# EAGLE design SAMD21E_Uno_Zero (EAGLE 7.3.0)
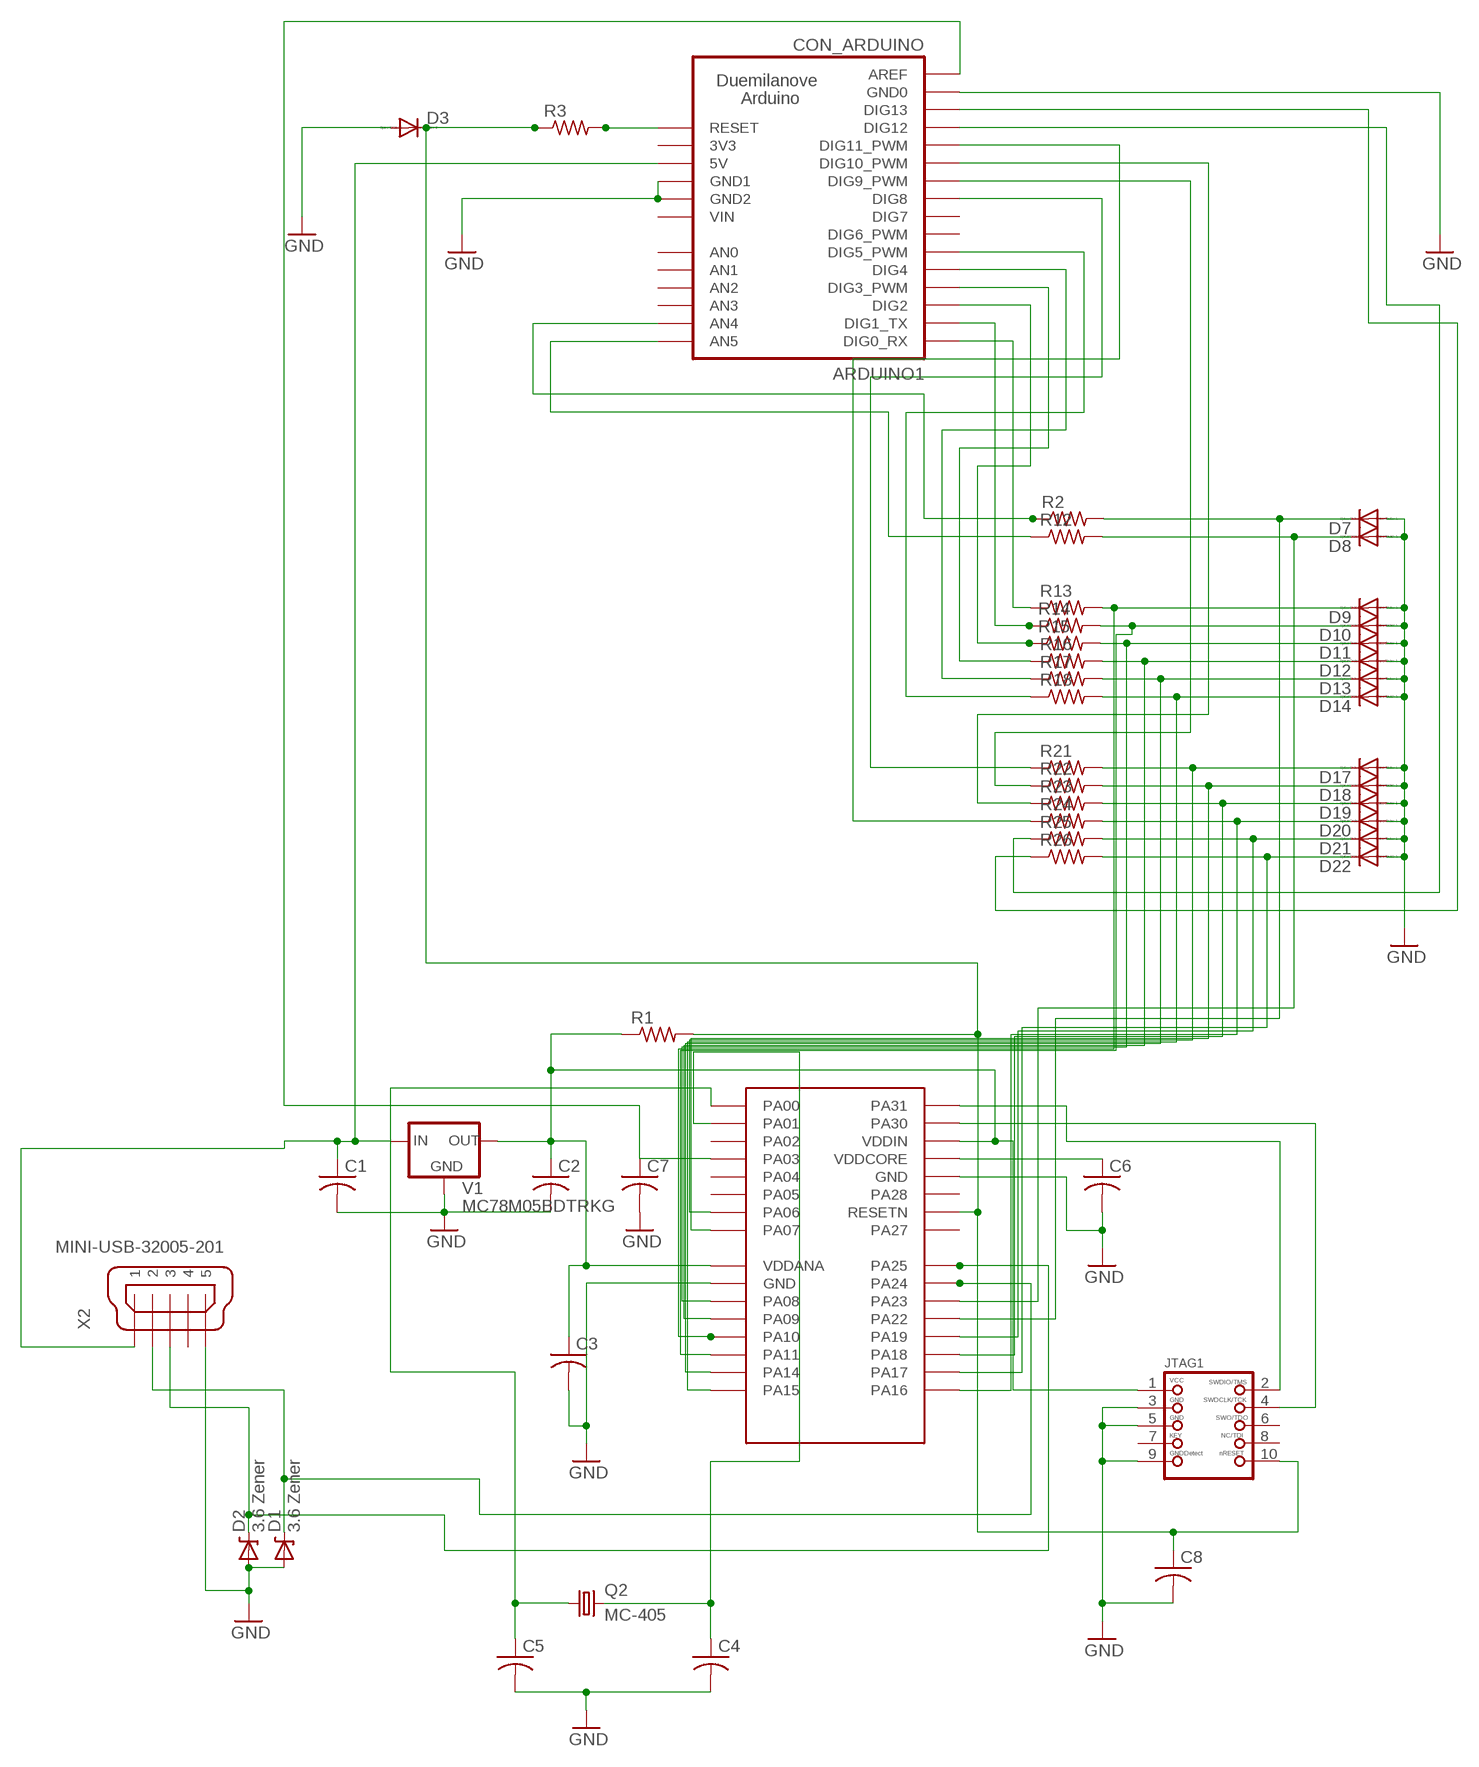
[diagram p0: schematic, sheet 1]

## Parts
ARDUINO1  CON_ARDUINO  [CON_ARDUINO]
C1  C-USC0603K  [C0603K]
C2  C-USC0603K  [C0603K]
C3  C-USC0603  [C0603]
C4  C-USC0603K  [C0603K]
C5  C-USC0603K  [C0603K]
C6  C-USC0603K  [C0603K]
C7  C-USC0603K  [C0603K]
C8  C-USC0603K  [C0603K]
D1  3.6 Zener  DIODE-ZENER-BZT52  [SOD-323]
D2  3.6 Zener  DIODE-ZENER-BZT52  [SOD-323]
D3  DIODE-SOD323-W  [SOD323-W]
D7  DIODE-SOD323-W  [SOD323-W]
D8  DIODE-SOD323-W  [SOD323-W]
D9  DIODE-SOD323-W  [SOD323-W]
D10  DIODE-SOD323-W  [SOD323-W]
D11  DIODE-SOD323-W  [SOD323-W]
D12  DIODE-SOD323-W  [SOD323-W]
D13  DIODE-SOD323-W  [SOD323-W]
D14  DIODE-SOD323-W  [SOD323-W]
D17  DIODE-SOD323-W  [SOD323-W]
D18  DIODE-SOD323-W  [SOD323-W]
D19  DIODE-SOD323-W  [SOD323-W]
D20  DIODE-SOD323-W  [SOD323-W]
D21  DIODE-SOD323-W  [SOD323-W]
D22  DIODE-SOD323-W  [SOD323-W]
JTAG1  JTAG-CORTEXM3  [2X05_1.27MM_SMT]
Q2  MC-405  [MC-405]
R1  R-US_R0603  [R0603]
R2  R-US_R0603  [R0603]
R3  R-US_R0603  [R0603]
R12  R-US_R0603  [R0603]
R13  R-US_R0603  [R0603]
R14  R-US_R0603  [R0603]
R15  R-US_R0603  [R0603]
R16  R-US_R0603  [R0603]
R17  R-US_R0603  [R0603]
R18  R-US_R0603  [R0603]
R21  R-US_R0603  [R0603]
R22  R-US_R0603  [R0603]
R23  R-US_R0603  [R0603]
R24  R-US_R0603  [R0603]
R25  R-US_R0603  [R0603]
R26  R-US_R0603  [R0603]
U$8  ATSAMD21E18A-AU  [32-TQFP]
V1  MC78M05BDTRKG  LP2950CDT-3.0  [DPACK]
X2  MINI-USB-32005-201  [32005-201]

## Nets
GND: ARDUINO1.GND0 ARDUINO1.GND1 ARDUINO1.GND2 C1.2 C2.2 C3.2 C4.2 C5.2 C6.2 C7.2 C8.2 D1.2(A) D2.2(A) D3.A D7.A D8.A D9.A D10.A D11.A D12.A D13.A D14.A D17.A D18.A D19.A D20.A D21.A D22.A JTAG1.3 JTAG1.5 JTAG1.9 U$8.10(GND) U$8.28(GND) V1.4(GND) X2.5
N$1: C2.1 C3.1 JTAG1.1 R1.1 U$8.9(VDDANA) U$8.30(VDDIN) V1.3(OUT)
N$2: JTAG1.4 U$8.31(PA30)
N$3: C4.1 Q2.2 U$8.2(PA01)
N$4: JTAG1.2 U$8.32(PA31)
N$5: C5.1 Q2.1 U$8.1(PA00)
N$6: ARDUINO1.RESET R3.2
N$7: C8.1 D3.C JTAG1.10 R1.2 R3.1 U$8.26(RESETN)
N$8: C6.1 U$8.29(VDDCORE)
N$10: D1.1(C) U$8.23(PA24) X2.2
N$11: D2.1(C) U$8.24(PA25) X2.3
N$12: ARDUINO1.AREF C7.1 U$8.4(PA03)
N$13: ARDUINO1.A_4(AN4) R2.1
N$14: ARDUINO1.A_5(AN5) R12.1
N$15: ARDUINO1.D_0(DIG0_RX) R13.1
N$16: ARDUINO1.5V C1.1 V1.1(IN) X2.1
N$17: ARDUINO1.D_1(DIG1_TX) R14.1
N$18: ARDUINO1.D_2(DIG2) R15.1
N$19: ARDUINO1.D_3(DIG3_PWM) R16.1
N$20: ARDUINO1.D_4(DIG4) R17.1
N$21: ARDUINO1.D_5(DIG5_PWM) R18.1
N$22: ARDUINO1.D_8(DIG8) R21.1
N$23: ARDUINO1.D_9(DIG9_PWM) R22.1
N$24: ARDUINO1.D_10(DIG10_PWM) R23.1
N$25: ARDUINO1.D_11(DIG11_PWM) R24.1
N$26: ARDUINO1.D_12(DIG12) R25.1
N$27: ARDUINO1.D_13(DIG13) R26.1
N$47: D7.C R2.2 U$8.21(PA22)
N$48: D8.C R12.2 U$8.22(PA23)
N$49: D9.C R13.2 U$8.13(PA10)
N$50: D10.C R14.2 U$8.14(PA11)
N$51: D11.C R15.2 U$8.11(PA08)
N$52: D12.C R16.2 U$8.12(PA09)
N$53: D13.C R17.2 U$8.15(PA14)
N$54: D14.C R18.2 U$8.16(PA15)
N$57: D17.C R21.2 U$8.7(PA06)
N$58: D18.C R22.2 U$8.8(PA07)
N$59: D19.C R23.2 U$8.19(PA18)
N$60: D20.C R24.2 U$8.17(PA16)
N$61: D21.C R25.2 U$8.20(PA19)
N$62: D22.C R26.2 U$8.18(PA17)
Unconnected: ARDUINO1.3V3 ARDUINO1.A_0(AN0) ARDUINO1.A_1(AN1) ARDUINO1.A_2(AN2) ARDUINO1.A_3(AN3) ARDUINO1.D_6(DIG6_PWM) ARDUINO1.D_7(DIG7) JTAG1.6 JTAG1.7 JTAG1.8 U$8.3(PA02) U$8.5(PA04) U$8.6(PA05) U$8.25(PA27) U$8.27(PA28) X2.4

## Power pins joined to a net without a drawn wire
VIN: ARDUINO1.VIN

## Library data of the parts
ARDUINO1 = dp_devices:CON_ARDUINO: Arduino board connector layout
C1 C2 C6-C8 = rcl:C-US: CAPACITOR, American symbol
C3-C5 = resistor:C-US: CAPACITOR, American symbol
D1 D2 = SparkFun:DIODE-ZENER: Zener Diode Production Part - 8199 3.4V Zener Voltage
D3 D7-D14 D17-D22 = diode:DIODE-: DIODE
JTAG1 = OLED_mod:JTAG-CORTEXM3: Serial Wire (SW-DP) Connector This standard 0.05" 10-pin connector is for use with the Cortex M0/M3's native SWD (serial wire debugger) interface (SW-DP). Some boards support a 20-pin combined JTAG+SWD connector (SWJ-DP), such as the LPC1700 family, but many smaller devices only work with SWD which typically use the smaller 10-pin SW-DP connecter (the LPC1300 family, for example, only supports SWD). 2x05 1.27mm/0.05" Connector: This is the standard SMT connector defined by ARM for all Cortex devices, and should be used in most situations and for forward-compatibility since any new devices coming to market will likely use this connector. MOLEX 10 Pin 0.1" Connector: This 0.1" 10 pin connector has the same pin layout as the standard 0.05" connector, but is easier to work with if you are using standard jumper wires or custom cables to connect your SWD hardware. MOLEX 20 Pin 0.1" Connector: This 0.1" 20 pin connector is the same model used for ARM7/ARM9 JTAG debuggers, but is connected to match the pins on the Segger J-Link for ARM (which supports both JTAG and SWD debugging). See the following document from ARM for more information on Cortex M3 Debug Connectors: http://infocenter.arm.com/help/topic/com.arm.doc.faqs/attached/13634/cortex_debug_connectors.pdf And the following page for an overview with images of the different connector types: http://www.keil.com/peripherals/coresight/connectors.asp
Q2 = crystal:MC-405: kHz RANGE CRYSTAL UNIT SMD Source: MC-306_405_406_E07X.PDF Homepage <http://www.epsontoyocom.co.jp>; OC_FARNELL: unknown; OC_NEWARK: unknown
R1 = rcl:R-US_: RESISTOR, American symbol
R2 R3 R12-R18 R21-R26 = resistor:R-US_: RESISTOR, American symbol
U$8 = atmel-samd21:ATSAMD21E18A-AU
V1 = v-reg:LP2950?*: Source: http://cache.national.com/ds/LP/LP2950.pdf
X2 = con-cypressindustries:MINI-USB-: MINI USB-B Conector Source: www.cypressindustries.com; OC_FARNELL: unknown; OC_NEWARK: unknown

## Board
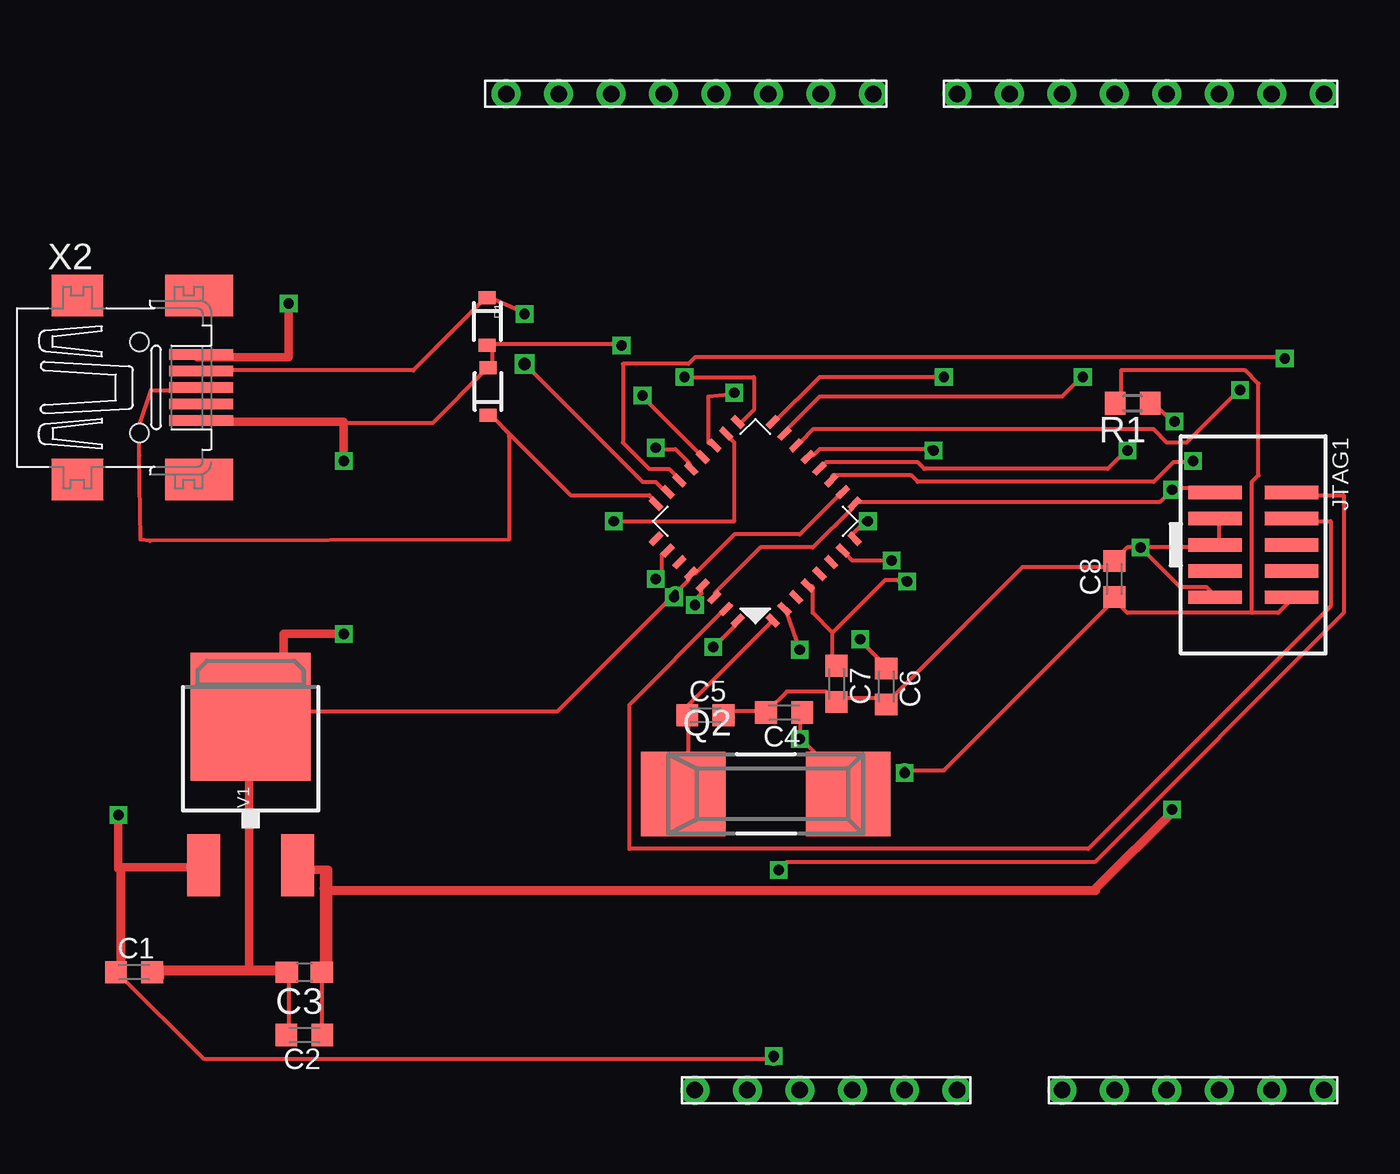
[diagram p1: board, top side]
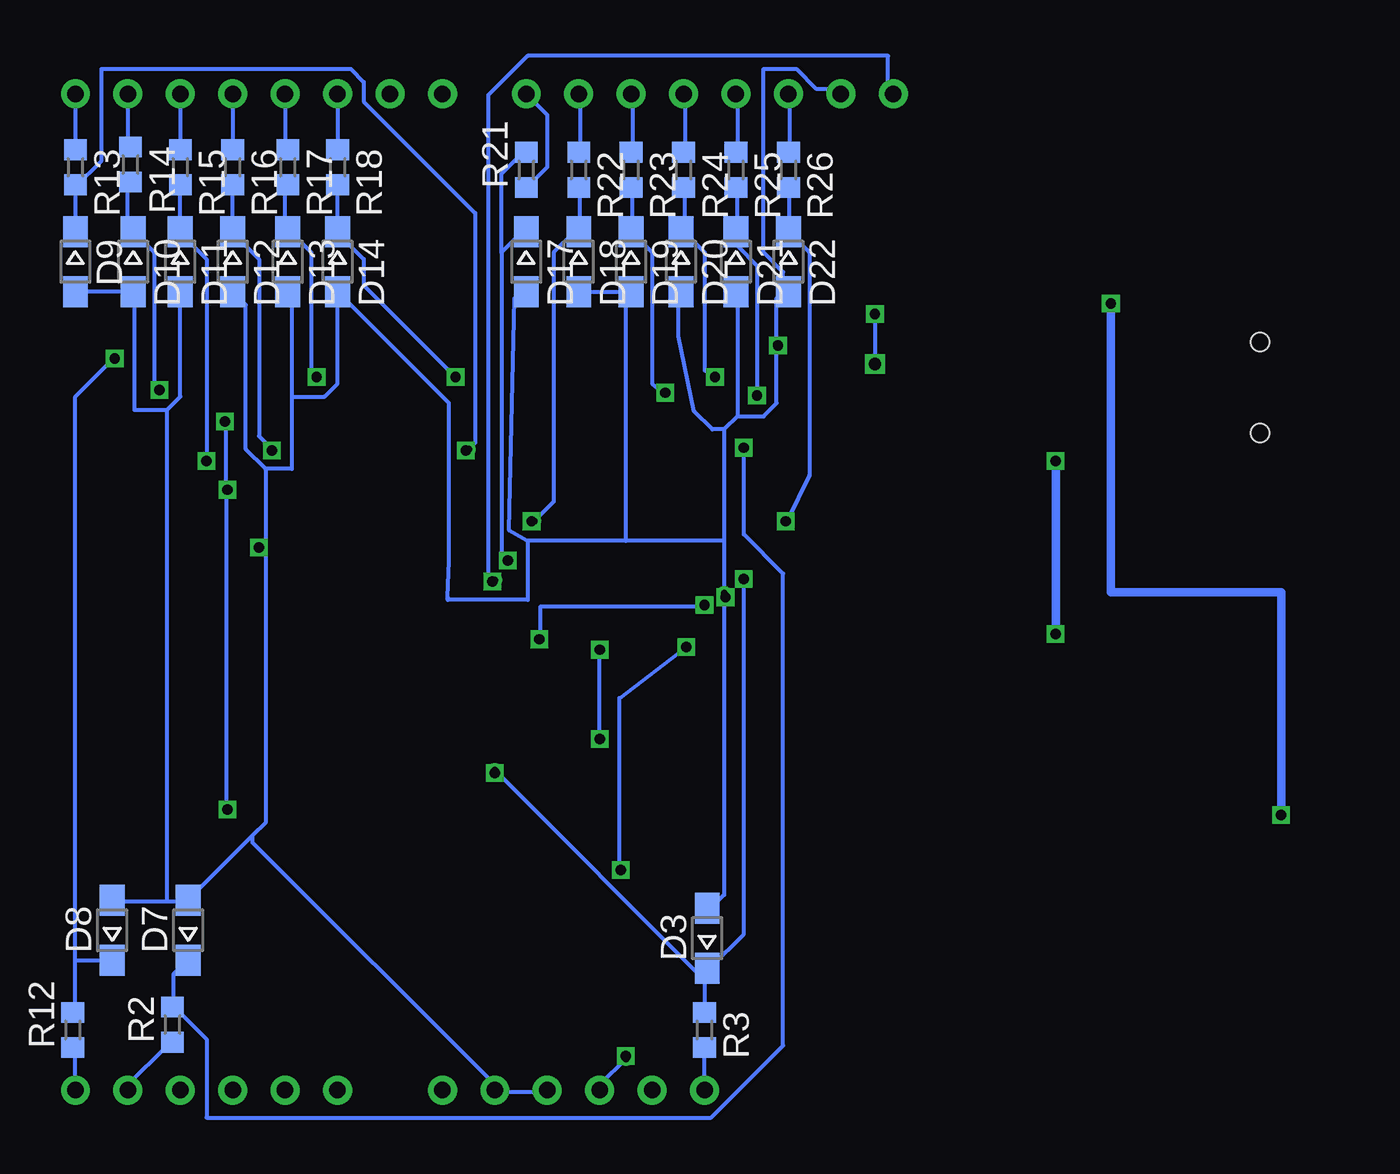
[diagram p2: board, bottom side, seen from below]

No outline drawn. Coordinates in mm, seen from the top.
Copper layers (1*16): Top 0.0356mm / dielectric 1.5011mm / Bottom 0.0356mm
Design rules "default": minimum track width 8mil, minimum drill 13mil, track to track 12mil, track to pad 12mil, pad to pad 12mil, via to via 12mil, smd to smd 8mil, copper to edge 15mil, drill to drill 12mil, minimum pad ring 7mil, minimum via ring 7mil, stop-mask expansion 4mil, vias tented up to drill 25mil, thermal gap 10mil
tRestrict: area 26.9,58.2 to 28.4,59.4; area 29.5,58 to 31,59.4; area 32.1,58 to 33.5,59.6; area 34.5,58 to 36.1,59.6; area 37.1,58 to 38.6,59.7; area 39.8,58 to 41.1,59.7; area 42,58 to 43.7,59.7; area 44.7,58 to 46.2,59.7; area 53.8,58 to 55.4,59.6; area 56.4,58 to 57.9,59.7; area 58.9,58 to 60.5,59.7; area 61.5,58 to 63,59.7; 8 more areas
vRestrict: area 34.6,33.3 to 44.4,43.1

### Footprints (pad centres in the part's own frame; a part is rotated, then mirrored left to right if it is on the bottom)
CON_ARDUINO = drill 0.8 pad 1.4: 3V3 25.4,-12.7; 5V 25.4,-10.16; A_0 25.4,2.54; A_1 25.4,5.08; A_2 25.4,7.62; A_3 25.4,10.16; A_4 25.4,12.7; A_5 25.4,15.24; AREF -22.86,-24.384; D_0 -22.86,15.24; D_1 -22.86,12.7; D_2 -22.86,10.16; D_3 -22.86,7.62; D_4 -22.86,5.08; D_5 -22.86,2.54; D_6 -22.86,0; D_7 -22.86,-2.54; D_8 -22.86,-6.604; D_9 -22.86,-9.144; D_10 -22.86,-11.684; D_11 -22.86,-14.224; D_12 -22.86,-16.764; D_13 -22.86,-19.304; GND0 -22.86,-21.844; GND1 25.4,-7.62; GND2 25.4,-5.08; RESET 25.4,-15.24; VIN 25.4,-2.54
C0603K = smd 1.05 x 1.08: 1 -0.875,0; 2 0.875,0
C0603 = smd 1.1 x 1: 1 -0.85,0; 2 0.85,0
SOD-323 = smd 0.63 x 0.83: 1 -1.15,0; 2 1.15,0
SOD323-W = smd 1.5 x 1.2: A 1.45,0; C -1.45,0
2X05_1.27MM_SMT = smd 0.65 x 2.6: 1 -2.54,-1.85; 2 -2.54,1.85; 3 -1.27,-1.85; 4 -1.27,1.85; 5 0,-1.85; 6 0,1.85; 7 1.27,-1.85; 8 1.27,1.85; 9 2.54,-1.85; 10 2.54,1.85
MC-405 = smd 4.1 x 4.1: 1 -4,0; 2 4,0
R0603 = smd 1 x 1.1: 1 -0.85,0; 2 0.85,0
32-TQFP = smd 0.7 x 0.3: 1 -4,2.8; 2 -4,2; 3 -4,1.2; 4 -4,0.4; 5 -4,-0.4; 6 -4,-1.2; 7 -4,-2; 8 -4,-2.8; 17 4,-2.8; 18 4,-2; 19 4,-1.2; 20 4,-0.4; 21 4,0.4; 22 4,1.2; 23 4,2; 24 4,2.8 | smd 0.3 x 0.7: 9 -2.8,-4; 10 -2,-4; 11 -1.2,-4; 12 -0.4,-4; 13 0.4,-4; 14 1.2,-4; 15 2,-4; 16 2.8,-4; 25 2.8,4; 26 2,4; 27 1.2,4; 28 0.4,4; 29 -0.4,4; 30 -1.2,4; 31 -2,4; 32 -2.8,4
DPACK = smd 1.6 x 3: 1 -2.28,-4.8; 3 2.28,-4.8 | smd 5.8 x 6.2: 4 0,2.38
32005-201 = smd 3.1 x 0.5: 1 3,1.6; 2 3,0.8; 3 3,0; 4 3,-0.8; 5 3,-1.6 | smd 2.5 x 2: M1 -3,-4.45; M2 -3,4.45 | smd 3.3 x 2: M3 2.9,4.45; M4 2.9,-4.45 | hole 0.9: 0,2.2; 0,-2.2

### Placement (x,y rotation side)
ARDUINO1  52.07,35.94 270 top
C1  9.65,16.26 0 top
C2  17.91,13.21 180 top
C3  17.91,16.26 180 top
C4  41.15,28.83 180 top
C5  37.34,28.7 0 top
C6  46.1,30.1 270 top
C7  43.69,30.23 270 top
C8  57.15,35.31 90 top
D1  26.76,47.77 270 top
D2  26.81,44.38 90 top
D3  36.7,17.91 90 bottom
D7  61.85,18.29 90 bottom
D8  65.53,18.29 90 bottom
D9  67.31,50.67 270 bottom
D10  64.52,50.67 270 bottom
D11  62.23,50.67 270 bottom
D12  59.69,50.67 270 bottom
D13  57.02,50.67 270 bottom
D14  54.61,50.67 270 bottom
D17  45.47,50.67 270 bottom
D18  42.93,50.67 270 bottom
D19  40.39,50.67 270 bottom
D20  37.97,50.67 270 bottom
D21  35.31,50.67 270 bottom
D22  32.77,50.67 270 bottom
JTAG1  63.88,36.96 270 top
Q2  40.26,24.89 0 top
R1  58.04,43.81 180 top
R2  62.61,13.72 90 bottom
R3  36.83,13.46 270 bottom
R12  67.44,13.46 90 bottom
R13  67.31,55.24 270 bottom
R14  64.64,55.37 270 bottom
R15  62.23,55.24 270 bottom
R16  59.69,55.24 270 bottom
R17  57.02,55.24 270 bottom
R18  54.61,55.24 270 bottom
R21  45.47,55.12 90 bottom
R22  42.93,55.12 270 bottom
R23  40.39,55.12 270 bottom
R24  37.85,55.12 270 bottom
R25  35.31,55.12 270 bottom
R26  32.77,55.12 270 bottom
U$8  39.75,38.1 135 top
V1  15.3,26.24 0 top
X2  9.91,44.58 0 top

### Tracks (layer width: path | path; a pad name or v marks a point on that pad's centre or on a via)
GND  (via drill 0.33, 0.5)
  Top 0.203: C5.2 38.42,28.89 40.01,28.89 C4.2 40.32,28.89 41.27,29.84 43.18,29.84 43.5,29.53 C7.2 43.81,29.53 46.04,29.53 C6.2 46.35,29.53 52.7,35.88 57.15,35.88 C8.2 57.15,36.2 57.78,36.83 v58.42,36.83 | v58.42,36.83 61.91,36.83 JTAG1.5 62.23,37.15 62.23,38.1 JTAG1.3 | v58.42,36.83 60.33,34.92 61.59,34.92 61.91,34.61 JTAG1.9 | U$8.10 43.81,39.37 41.91,37.47 38.73,37.47 36.83,35.56 U$8.28 36.51,35.24 v35.88,34.61 30.16,28.89 15.56,28.89 V1.4 15.24,28.57 15.24,25.91 | 15.24,16.19 16.83,16.19 C3.2 17.14,16.19 17.14,13.34 C2.2 | 15.24,16.19 10.79,16.19 C1.2 | 15.24,16.38 15.24,16.19 | X2.5 13.02,42.86 24.13,42.86 26.67,45.4 D2.2 26.99,45.72 26.99,46.35 D1.2 26.99,46.67 v33.34,46.67
  Top 0.406: 15.24,25.91 15.24,16.38 | 15.24,16.38 16.76,16.38 16.76,16.26 | 15.24,16.38 10.92,16.38 10.92,16
  Bottom 0.203: D11.A 62.23,44.13 62.87,43.5 | 62.87,43.5 64.45,43.5 64.45,49.21 D10.A 64.77,49.21 D9.A | ARDUINO1.GND1 44.45,10.48 46.99,10.48 ARDUINO1.GND2 46.99,10.79 58.74,22.54 58.74,22.86 | 62.87,19.68 65.41,19.68 D8.A | 62.87,19.68 61.91,19.68 D7.A 61.59,20 58.74,22.86 | D14.A 54.61,44.77 55.24,44.13 56.83,44.13 | 56.83,44.13 56.83,49.21 D13.A | 58.1,40.64 59.05,41.59 59.05,48.58 D12.A | 58.1,40.64 56.83,40.64 56.83,44.13 | 58.74,22.86 58.1,23.5 58.1,36.83 | 58.1,40.64 58.1,36.83 | 62.87,19.68 62.87,43.5 | 58.1,36.83 v58.42,36.83 | 40.64,49.21 42.86,49.21 D18.A | 35.24,43.18 33.97,43.18 33.34,43.81 v33.34,46.67 33.34,48.9 33.02,49.21 D22.A 33.02,49.53 33.02,50.16 33.97,51.12 33.97,60.01 32.38,60.01 31.43,59.05 30.48,59.05 ARDUINO1.GND0 | 35.24,43.18 35.24,49.21 D21.A | 35.88,42.55 35.88,37.15 | 35.88,37.15 v35.88,34.61 35.88,20 36.51,19.37 D3.A | 35.24,43.18 35.88,42.55 | 35.88,42.55 36.45,42.55 37.34,43.43 38.1,47.05 38.1,49.21 D20.A | 45.4,37.15 46.29,37.66 46.04,48.9 45.72,49.21 D17.A | 35.88,37.15 40.64,37.15 | 40.64,37.15 45.4,37.15 | 40.64,37.15 40.64,49.21 | 40.64,49.21 D19.A | D14.A 49.21,43.81 49.21,36.2 49.28,34.42 49.28,34.29 45.4,34.29 45.4,37.15 | D14.A
N$1  (via drill 0.33, 0.5)
  Top 0.203: C2.1 18.73,13.34 18.73,16.19 C3.1 18.73,16.51 18.73,20.32 | 18.73,20.32 18.73,21.27 17.78,21.27 V1.3 | v60.01,42.86 59.05,43.81 R1.1 | JTAG1.1 61.91,39.69 v60.01,39.69 v59.94,39.62 59.37,39.05 44.77,39.05 U$8.9 44.45,38.73 42.55,36.83 40.01,36.83 37.78,34.61 U$8.30 | 18.73,20.32 56.2,20.32 v60.01,24.13
  Bottom 0.203: v60.01,42.86 v60.01,39.69 v60.01,24.13
N$2
  Top 0.203: U$8.31 38.1,33.66 33.66,29.21 33.66,22.23 55.88,22.23 67.63,33.97 67.63,38.1 66.04,38.1 JTAG1.4
N$3  (via drill 0.33, 0.5)
  Top 0.203: v41.91,31.88 41.27,33.66 U$8.2 | C4.1 41.91,28.57 v41.91,27.62 44.45,25.08 Q2.2
  Bottom 0.203: v41.91,27.62 v41.91,31.88
N$4  (via drill 0.33, 0.5)
  Top 0.203: v37.72,32 38.73,33.02 U$8.32 | v40.96,21.27 41.27,21.59 56.2,21.59 68.26,33.66 68.26,39.37 66.04,39.37 JTAG1.2
  Bottom 0.203: v37.72,32 40.96,29.53 v40.96,21.27
N$5
  Top 0.203: U$8.1 40.64,33.34 36.2,28.89 C5.1 36.51,28.57 36.51,25.08 Q2.1
N$6
  Bottom 0.203: ARDUINO1.RESET R3.2
N$7  (via drill 0.33)
  Top 0.203: 57.15,34.29 57.78,33.66 63.82,33.66 | 63.82,33.66 65.09,33.66 65.72,34.29 JTAG1.10 | 63.82,33.66 63.82,40.01 64.14,40.32 64.14,44.77 63.5,45.4 57.47,45.4 57.47,43.81 R1.2 | v34.92,35.24 35.24,35.24 35.24,36.51 U$8.26 | 57.15,34.29 48.9,26.04 v46.99,26.04 | 57.15,34.29 C8.1
  Bottom 0.203: v34.92,35.24 34.92,18.1 36.51,16.51 D3.C | 36.83,15.88 36.83,16.19 D3.C | 36.83,15.88 R3.1 | 36.83,15.88 v46.99,26.04 | 36.83,15.88 D3.C
N$8  (via drill 0.33)
  Top 0.203: v36.83,33.97 36.83,34.29 37.15,34.61 37.15,34.92 U$8.29 | v44.77,32.38 46.04,31.11 C6.1
  Bottom 0.203: v36.83,33.97 44.77,33.97 v44.77,32.38
N$9  (via drill 0.5)
  other vias: 33.27,46.61
N$10  (via drill 0.33, 0.5, 0.6)
  Top 0.203: v28.57,45.72 34.29,40.01 34.92,40.01 35.24,39.69 U$8.23 | v28.57,48.2 26.99,48.9 D1.1 26.67,48.9 23.18,45.4 13.02,45.4 X2.2
  Bottom 0.203: v28.57,48.2 v28.57,48.13 v28.57,45.72
N$11
  Top 0.203: 27.94,42.23 26.99,43.18 D2.1 | 27.94,42.23 30.8,39.37 34.61,39.37 34.92,39.05 U$8.24 | 27.94,42.23 27.81,42.23 27.81,37.21 10.41,37.15 9.97,37.21 9.91,41.27 9.91,42.74 10.48,44.45 12.7,44.45 X2.3
N$12  (via drill 0.33)
  Top 0.203: 43.5,32.7 42.55,33.66 42.55,34.92 U$8.4 | 43.5,32.7 43.5,31.11 C7.1 | 43.5,32.7 46.04,35.24 v46.99,35.24
  Bottom 0.203: v46.99,35.24 47.31,35.56 47.31,58.74 45.4,60.64 27.94,60.64 27.94,59.05 ARDUINO1.AREF
N$13
  Bottom 0.203: R2.1 62.87,12.7 64.77,10.79 ARDUINO1.A_4
N$14
  Bottom 0.203: ARDUINO1.A_5 67.31,12.38 R12.1
N$15
  Bottom 0.203: ARDUINO1.D_0 R13.1
N$16  (via drill 0.33, 0.5)
  Top 0.203: V1.1 12.7,21.27 8.89,21.27 8.89,16.51 C1.1 8.89,16.19 13.02,12.06 v40.64,12.06 | 12.7,46.04 X2.1
  Top 0.406: 12.7,46.04 17.14,46.04 v17.14,48.64 | v8.89,23.88 8.89,21.34 | 8.89,21.34 8.89,21.27 | 8.89,21.34 9.02,21.34 | 9.02,21.34 12.57,21.34 | 9.02,21.34 9.02,16.13
  Bottom 0.203: v40.64,12.06 41.91,10.79 ARDUINO1.5V
  Bottom 0.406: v17.14,48.64 17.14,34.67 8.89,34.67 v8.89,23.88
N$17
  Bottom 0.203: ARDUINO1.D_1 64.77,56.52 R14.1
N$18
  Bottom 0.203: ARDUINO1.D_2 R15.1
N$19
  Bottom 0.203: ARDUINO1.D_3 R16.1
N$20
  Bottom 0.203: ARDUINO1.D_4 57.15,56.2 R17.1
N$21
  Bottom 0.203: ARDUINO1.D_5 R18.1
N$22
  Bottom 0.203: ARDUINO1.D_8 44.45,57.78 44.45,55.24 45.4,54.29 R21.1
N$23
  Bottom 0.203: R22.1 42.86,56.2 42.86,58.74 ARDUINO1.D_9
N$24
  Bottom 0.203: R23.1 40.32,56.2 40.32,58.74 ARDUINO1.D_10
N$25
  Bottom 0.203: R24.1 37.78,56.2 37.78,58.74 ARDUINO1.D_11
N$26
  Bottom 0.203: R25.1 35.24,56.2 35.24,58.74 ARDUINO1.D_12
N$27
  Bottom 0.203: R26.1 32.7,56.2 32.7,58.74 ARDUINO1.D_13
N$28  (via drill 0.5)
  other vias: 36.32,45.09
N$29  (via drill 0.5)
  other vias: 38.73,44.32
N$30  (via drill 0.5)
  other vias: 55.63,45.09
N$31  (via drill 0.5)
  other vias: 65.41,45.97
N$32  (via drill 0.5)
  other vias: 63.25,44.45
N$33  (via drill 0.5)
  other vias: 60.07,42.93
N$34  (via drill 0.5)
  other vias: 57.78,41.53
N$35  (via drill 0.5)
  other vias: 48.39,41.53
N$36  (via drill 0.5)
  other vias: 47.12,35.18
N$37  (via drill 0.5)
  other vias: 44.83,32.38
N$38  (via drill 0.5)
  other vias: 45.21,38.1
N$39  (via drill 0.5)
  other vias: 36.83,34.04
N$40  (via drill 0.5)
  other vias: 35.81,34.42
N$41  (via drill 0.5)
  other vias: 34.92,35.31
N$42  (via drill 0.5)
  other vias: 34.92,41.66
N$43  (via drill 0.5)
  other vias: 40.89,21.21
N$44  (via drill 0.5)
  other vias: 41.91,27.56
N$45  (via drill 0.5)
  other vias: 46.99,25.91
N$46  (via drill 0.5)
  other vias: 59.94,24.13
N$47  (via drill 0.33)
  Top 0.203: v34.92,41.59 35.88,41.59 36.51,40.96 U$8.21
  Bottom 0.203: v34.92,41.59 34.92,37.47 33.02,35.56 33.02,12.7 36.51,9.21 60.96,9.21 60.96,13.02 62.55,14.61 | 62.55,14.61 62.55,16.19 61.91,16.83 D7.C | 62.55,14.61 R2.2
N$48  (via drill 0.33)
  Top 0.203: v65.41,46.04 36.83,46.04 36.51,45.72 33.34,45.72 33.34,41.91 34.61,40.64 35.56,40.64 35.88,40.32 U$8.22
  Bottom 0.203: v65.41,46.04 67.31,44.13 67.31,16.83 | 67.31,16.83 67.31,14.61 R12.2 | 67.31,16.83 65.72,16.83 D8.C
N$49  (via drill 0.33)
  Top 0.203: v48.26,41.59 42.86,41.59 42.55,41.27 U$8.13
  Bottom 0.203: v48.26,41.59 47.94,41.91 47.94,53.02 53.34,58.42 53.34,59.37 53.98,60.01 66.04,60.01 66.04,55.56 67.31,54.29 | 67.31,54.29 D9.C | 67.31,54.29 R13.2
N$50  (via drill 0.33)
  Top 0.203: v63.18,44.45 60.64,41.91 59.69,41.91 59.05,42.55 42.55,42.55 41.91,41.91 U$8.14
  Bottom 0.203: v63.18,44.45 63.5,44.77 63.5,51.12 64.45,52.07 D10.C 64.77,52.39 64.77,54.29 R14.2
N$51  (via drill 0.33, 0.5)
  Top 0.203: v60.96,40.96 60.01,40.96 59.05,40.01 47.62,40.01 47.31,40.32 43.5,40.32 U$8.11
  Bottom 0.203: v60.96,40.96 v60.96,41.02 60.96,50.8 62.23,52.07 D11.C R15.2
N$52  (via drill 0.33)
  Top 0.203: v57.78,41.59 56.83,40.64 47.94,40.64 47.62,40.96 43.18,40.96 U$8.12
  Bottom 0.203: v57.78,41.59 58.42,42.23 58.42,50.8 59.69,52.07 D12.C R16.2
N$53  (via drill 0.33)
  Top 0.203: v55.56,45.09 54.61,44.13 42.86,44.13 41.27,42.55 U$8.15
  Bottom 0.203: v55.56,45.09 55.88,45.4 55.88,51.12 56.83,52.07 D13.C 57.15,52.39 57.15,54.29 R17.2
N$54  (via drill 0.33, 0.5)
  Top 0.203: v48.9,45.09 42.86,45.09 40.64,42.86 U$8.16
  Bottom 0.203: v48.9,45.09 53.34,49.53 53.34,50.8 54.61,52.07 D14.C R18.2
N$55  (via drill 0.5)
  other vias: 40.64,12.19
N$56  (via drill 0.5)
  Top 0.406: 14.35,42.93 19.81,42.93 v19.81,41.02 19.81,40.89 | v19.81,32.64 16.89,32.64 16.89,31.11
  Bottom 0.406: 19.81,40.89 v19.81,32.64
N$57  (via drill 0.33, 0.5)
  Top 0.203: v46.35,36.2 44.45,36.2 44.13,36.51 U$8.7
  Bottom 0.203: v46.35,36.2 46.67,36.51 46.67,51.12 | 46.67,51.12 45.72,52.07 D17.C | 46.67,51.12 46.67,54.93 45.72,55.88 R21.2
N$58  (via drill 0.33)
  Top 0.203: v45.09,38.1 44.45,37.47 U$8.8
  Bottom 0.203: v45.09,38.1 44.13,39.05 44.13,51.12 43.18,52.07 D18.C 42.86,52.39 42.86,53.98 R22.2
N$59  (via drill 0.33)
  Top 0.203: v38.73,44.26 37.47,44.13 37.47,41.91 U$8.19
  Bottom 0.203: v38.73,44.26 39.37,44.77 39.37,51.12 40.32,52.07 D19.C 40.32,52.39 40.32,53.98 R23.2
N$60  (via drill 0.33)
  Top 0.203: v36.26,45.09 39.69,45.09 39.69,43.5 39.05,42.86 U$8.17
  Bottom 0.203: v36.26,45.09 36.83,45.4 36.83,51.12 37.78,52.07 D20.C 37.78,52.39 37.78,53.98 R24.2
N$61  (via drill 0.33, 0.5)
  Top 0.203: v34.29,44.13 37.15,41.27 U$8.20
  Bottom 0.203: v34.29,44.13 v34.29,44.2 34.29,50.48 35.24,51.44 35.24,52.07 D21.C 35.24,52.39 35.24,53.98 R25.2
N$62  (via drill 0.33, 0.5)
  Top 0.203: v32.83,38.1 v32.89,38.1 38.73,38.1 38.73,41.91 38.42,42.23 U$8.18
  Bottom 0.203: v32.83,38.1 31.75,40.32 31.75,51.12 32.7,52.07 D22.C 32.7,52.39 32.7,53.98 R26.2
N$63
  Top 0.406: 18.41,21.21 19.05,21.21 19.05,16.13
N$64
  Top 0.406: 19.18,20.19 56.26,20.19 56.26,20.32 60.07,24.13